# Altium project Mega project.PrjPcb
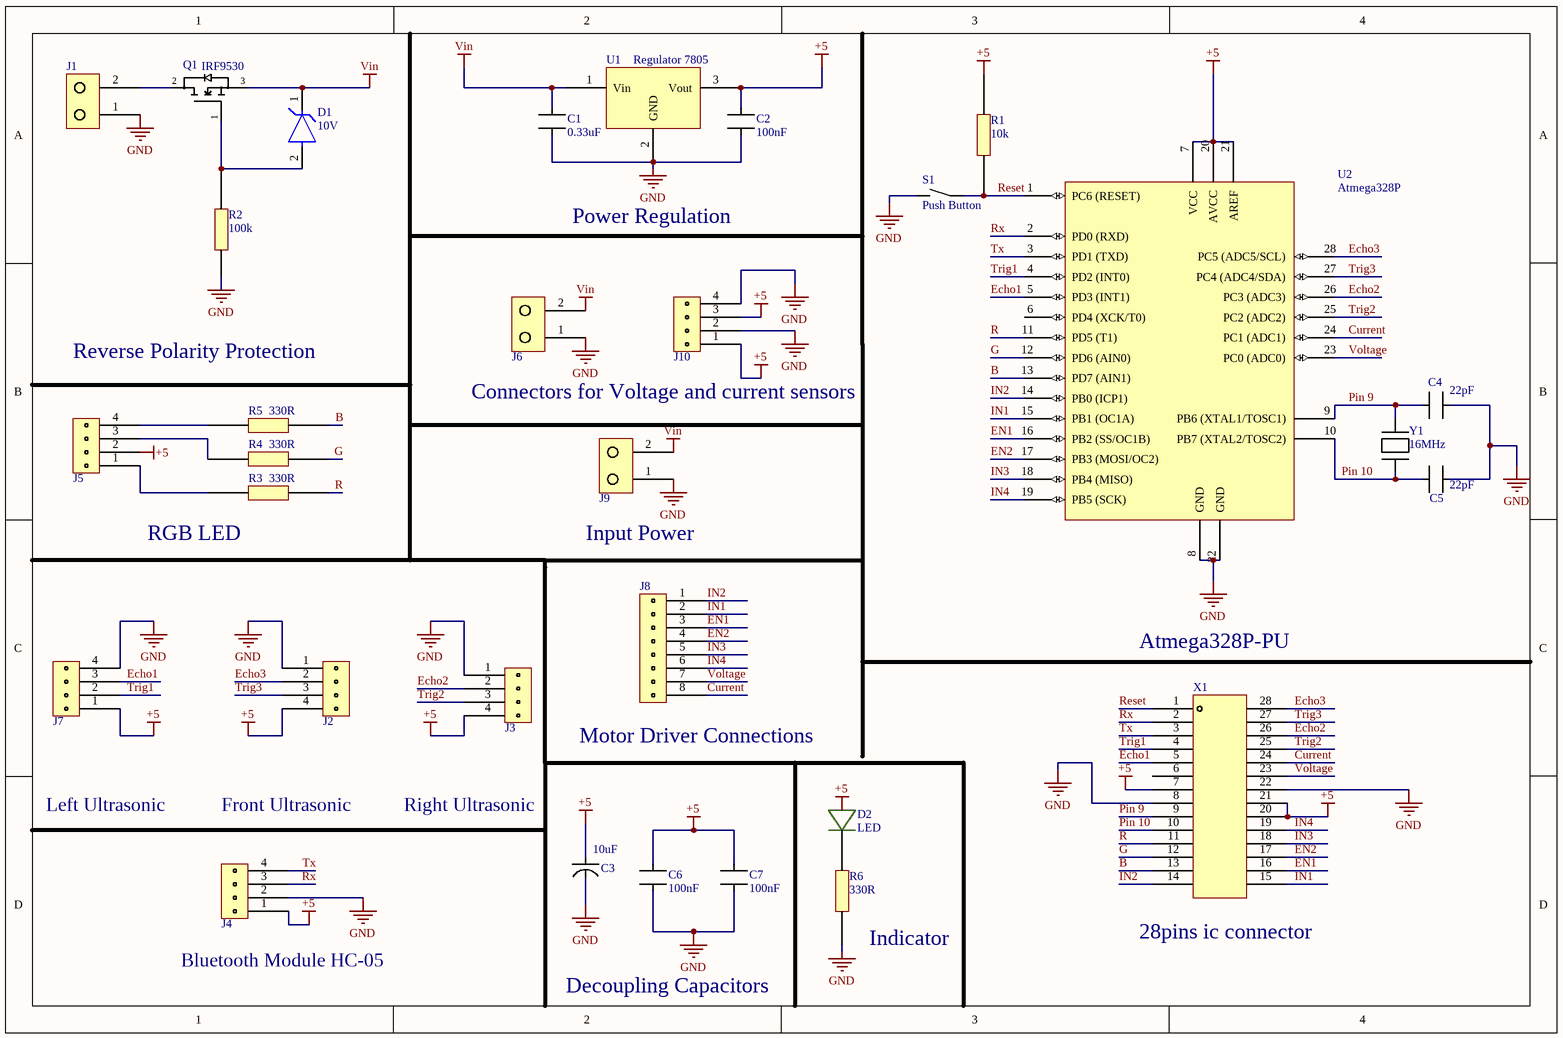
[diagram p0: Sheet1.SchDoc]
1 sheet, 31 parts. Net scope: global (net labels, ports and power ports of the same name join across sheets).
Board file: Mega_pcb.PcbDoc

## Sheet Sheet1.SchDoc
size A4; SheetNumber: 1; SheetTotal: 1

### Parts
C1  0.33uF  [Capacitor 100nF THT]
C2  100nF  [Capacitor 100nF THT]
C3  10uF  [Pol cap 10uF]
C4  22pF  [Capacitor 22pF THT]
C5  22pF  [Capacitor 22pF THT]
C6  100nF  [Capacitor 100nF THT]
C7  100nF  [Capacitor 100nF THT]
D1  10V  [FP-017AH-MFG]
D2  LED  [Green Led 5mm]
J1  Teminal block 2pins  [Terminal Block]  (value not drawn)
J2  Pin Headers 4 pins  [Pin Headers 4 pins]  (value not drawn)
J3  Pin Headers 4 pins  [Pin Headers 4 pins]  (value not drawn)
J4  Pin Headers 4 pins  [Pin Headers 4 pins]  (value not drawn)
J5  Pin Headers 4 pins  [Pin Headers 4 pins]  (value not drawn)
J6  Teminal block 2pins  [Terminal Block]  (value not drawn)
J7  Pin Headers 4 pins  [Pin Headers 4 pins]  (value not drawn)
J8  Pin Headers 8 Pin Female  [Pin Headers 8 Pin Female]  (value not drawn)
J9  Teminal block 2pins  [Terminal Block]  (value not drawn)
J10  Pin Headers 4 pins  [Pin Headers 4 pins]  (value not drawn)
Q1  IRF9530  [IRF9530]
R1  10k  [Carbon Resistor 1k Ohm 0.25W]
R2  100k  [Carbon Resistor 10k Ohm 0.25W]
R3  330R  [Carbon Resistor 1k Ohm 0.25W]
R4  330R  [Carbon Resistor 1k Ohm 0.25W]
R5  330R  [Carbon Resistor 1k Ohm 0.25W]
R6  330R  [Carbon Resistor 1k Ohm 0.25W]
S1  Push Button  [PushButton 2 pins]
U1  Regulator 7805  [Regulator LM7805 THT]
U2  Atmega328P  [Atmega328P]
X1  28Pins ic holder  [28 pins ic holder]  (value not drawn)
Y1  16MHz  [Crystal 16MHz]

### Nets
+5: C2.2 C3.1 C6.2 C7.2 D2.1 J2.4 J3.4 J4.1 J5.2 J7.1 J10.1 J10.3 R1.1 U1.3(Vout) U2.7(VCC) U2.20(AVCC) U2.21(AREF) X1.7 X1.20 X1.21
GND: C1.1 C2.1 C3.2 C4.1 C5.1 C6.1 C7.1 J1.1 J2.1 J3.1 J4.2 J6.1 J7.4 J9.1 J10.2 J10.4 R2.2 R6.2 S1.1 U1.2(GND) U2.8(GND) U2.22(GND) X1.8 X1.22
Vin: C1.2 D1.1(C) J6.2 J9.2 Q1.3(S) U1.1(Vin)
B: R5.2 U2.13(PD7_(AIN1)) X1.13
Current: J8.8 U2.24(PC1_(ADC1)) X1.24
Echo1: J7.3 U2.5(PD3_(INT1)) X1.5
Echo2: J3.2 U2.26(PC3_(ADC3)) X1.26
Echo3: J2.2 U2.28(PC5_(ADC5/SCL)) X1.28
EN1: J8.3 U2.16(PB2_(SS/OC1B)) X1.16
EN2: J8.4 U2.17(PB3_(MOSI/OC2)) X1.17
G: R4.2 U2.12(PD6_(AIN0)) X1.12
IN1: J8.2 U2.15(PB1_(OC1A)) X1.15
IN2: J8.1 U2.14(PB0_(ICP1)) X1.14
IN3: J8.5 U2.18(PB4_(MISO)) X1.18
IN4: J8.6 U2.19(PB5_(SCK)) X1.19
Pin 9: C4.2 U2.9(PB6_(XTAL1/TOSC1)) X1.9 Y1.2
Pin 10: C5.2 U2.10(PB7_(XTAL2/TOSC2)) X1.10 Y1.1
R: R3.2 U2.11(PD5_(T1)) X1.11
Reset: R1.2 S1.2 U2.1(PC6_(RESET)) X1.1
Rx: J4.3 U2.2(PD0_(RXD)) X1.2
Trig1: J7.2 U2.4(PD2_(INT0)) X1.4
Trig2: J3.3 U2.25(PC2_(ADC2)) X1.25
Trig3: J2.3 U2.27(PC4_(ADC4/SDA)) X1.27
Tx: J4.4 U2.3(PD1_(TXD)) X1.3
Voltage: J8.7 U2.23(PC0_(ADC0)) X1.23
NetD1_2: D1.2(A) Q1.1(G) R2.1
NetD2_2: D2.2 R6.1
NetJ1_2: J1.2 Q1.2(D)
NetJ5_1: J5.1 R3.1
NetJ5_3: J5.3 R4.1
NetJ5_4: J5.4 R5.1

Not connected (* = marked no-connect by the designer): U2 6(PD4_(XCK/T0)); X1 6

### Notes on the sheet
- Power Regulation
- Reverse Polarity Protection
- Connectors for Voltage and current sensors
- (near R3) RGB LED
- Input Power
- Atmega328P-PU
- (near J8) Motor Driver Connections
- Left Ultrasonic
- Front Ultrasonic
- Right Ultrasonic
- (near J4) Bluetooth Module HC-05
- (near R6) Indicator
- (near X1) 28pins ic connector
- Decoupling Capacitors

### Library data of the parts
C1 C2 C6 C7 = Capacitor 100nF THT
C3 = Capacitor (POL) 10uF THT
C4 C5 = Capacitor 22pF THT
D1 = CMP-00278-84408782-1: 1N4740ATR 1N4740 Series 1 W 10 V 10 uA Through Hole Zener Diode - DO-41; Manufacturer Lifecycle Status: ACTIVE; Max Power Dissipation: 1W; Voltage Tolerance: 5%; Zener Current: 25mA; ESD Protection: No; Output Current: 1A; Peak Reverse Current: 10µA; Impedance: 7Ω; Element Configuration: Single; Material: Glass; Zener Voltage: 10V; RoHS: Compliant; Lead Free: Lead Free; Working Voltage: 10V; Width: 6.35mm; Test Current: 25mA; Voltage Rating (DC): 10V; Number of Pins: 2; Packaging: Cut Tape; Radiation Hardening: No; Schedule B: 8541100050, 8541100050; Contact Plating: Tin; Power Rating: 1W; Height: 6.35mm; Diameter: 2.72mm; Mount: Through Hole; Weight: 245mg; Lifecycle Status: Production; NexarPartId: 84408782; Length: 5.2mm; Tolerance: 5%; Max Operating Temperature: 200°C; Power Dissipation: 1W; Max Reverse Leakage Current: 10µA; Min Operating Temperature: -65°C; REACH SVHC: No SVHC
D2 = Green LED
R1 R6 = Resistor THT
R2 = Resistor 10k Ohms THT
R3-R5 = Resistor tht
Y1 = 16MHz Crystal
U2 = Atmega328P: Parameter 1: *; Parameter 2: *; Parameter 3: *; Parameter 4: *